# EasyEDA Pro project ProProject_CAM1320_2024-01-19.epro

# Schematic Schematic1
Create Date: 2024-01-09; Page Name: P1; Project Name: CAM1320; Schematic Name: Schematic1; Update Date: 2024-01-09; Company: 嘉立创EDA; Page Size: A4; Version: V1.0
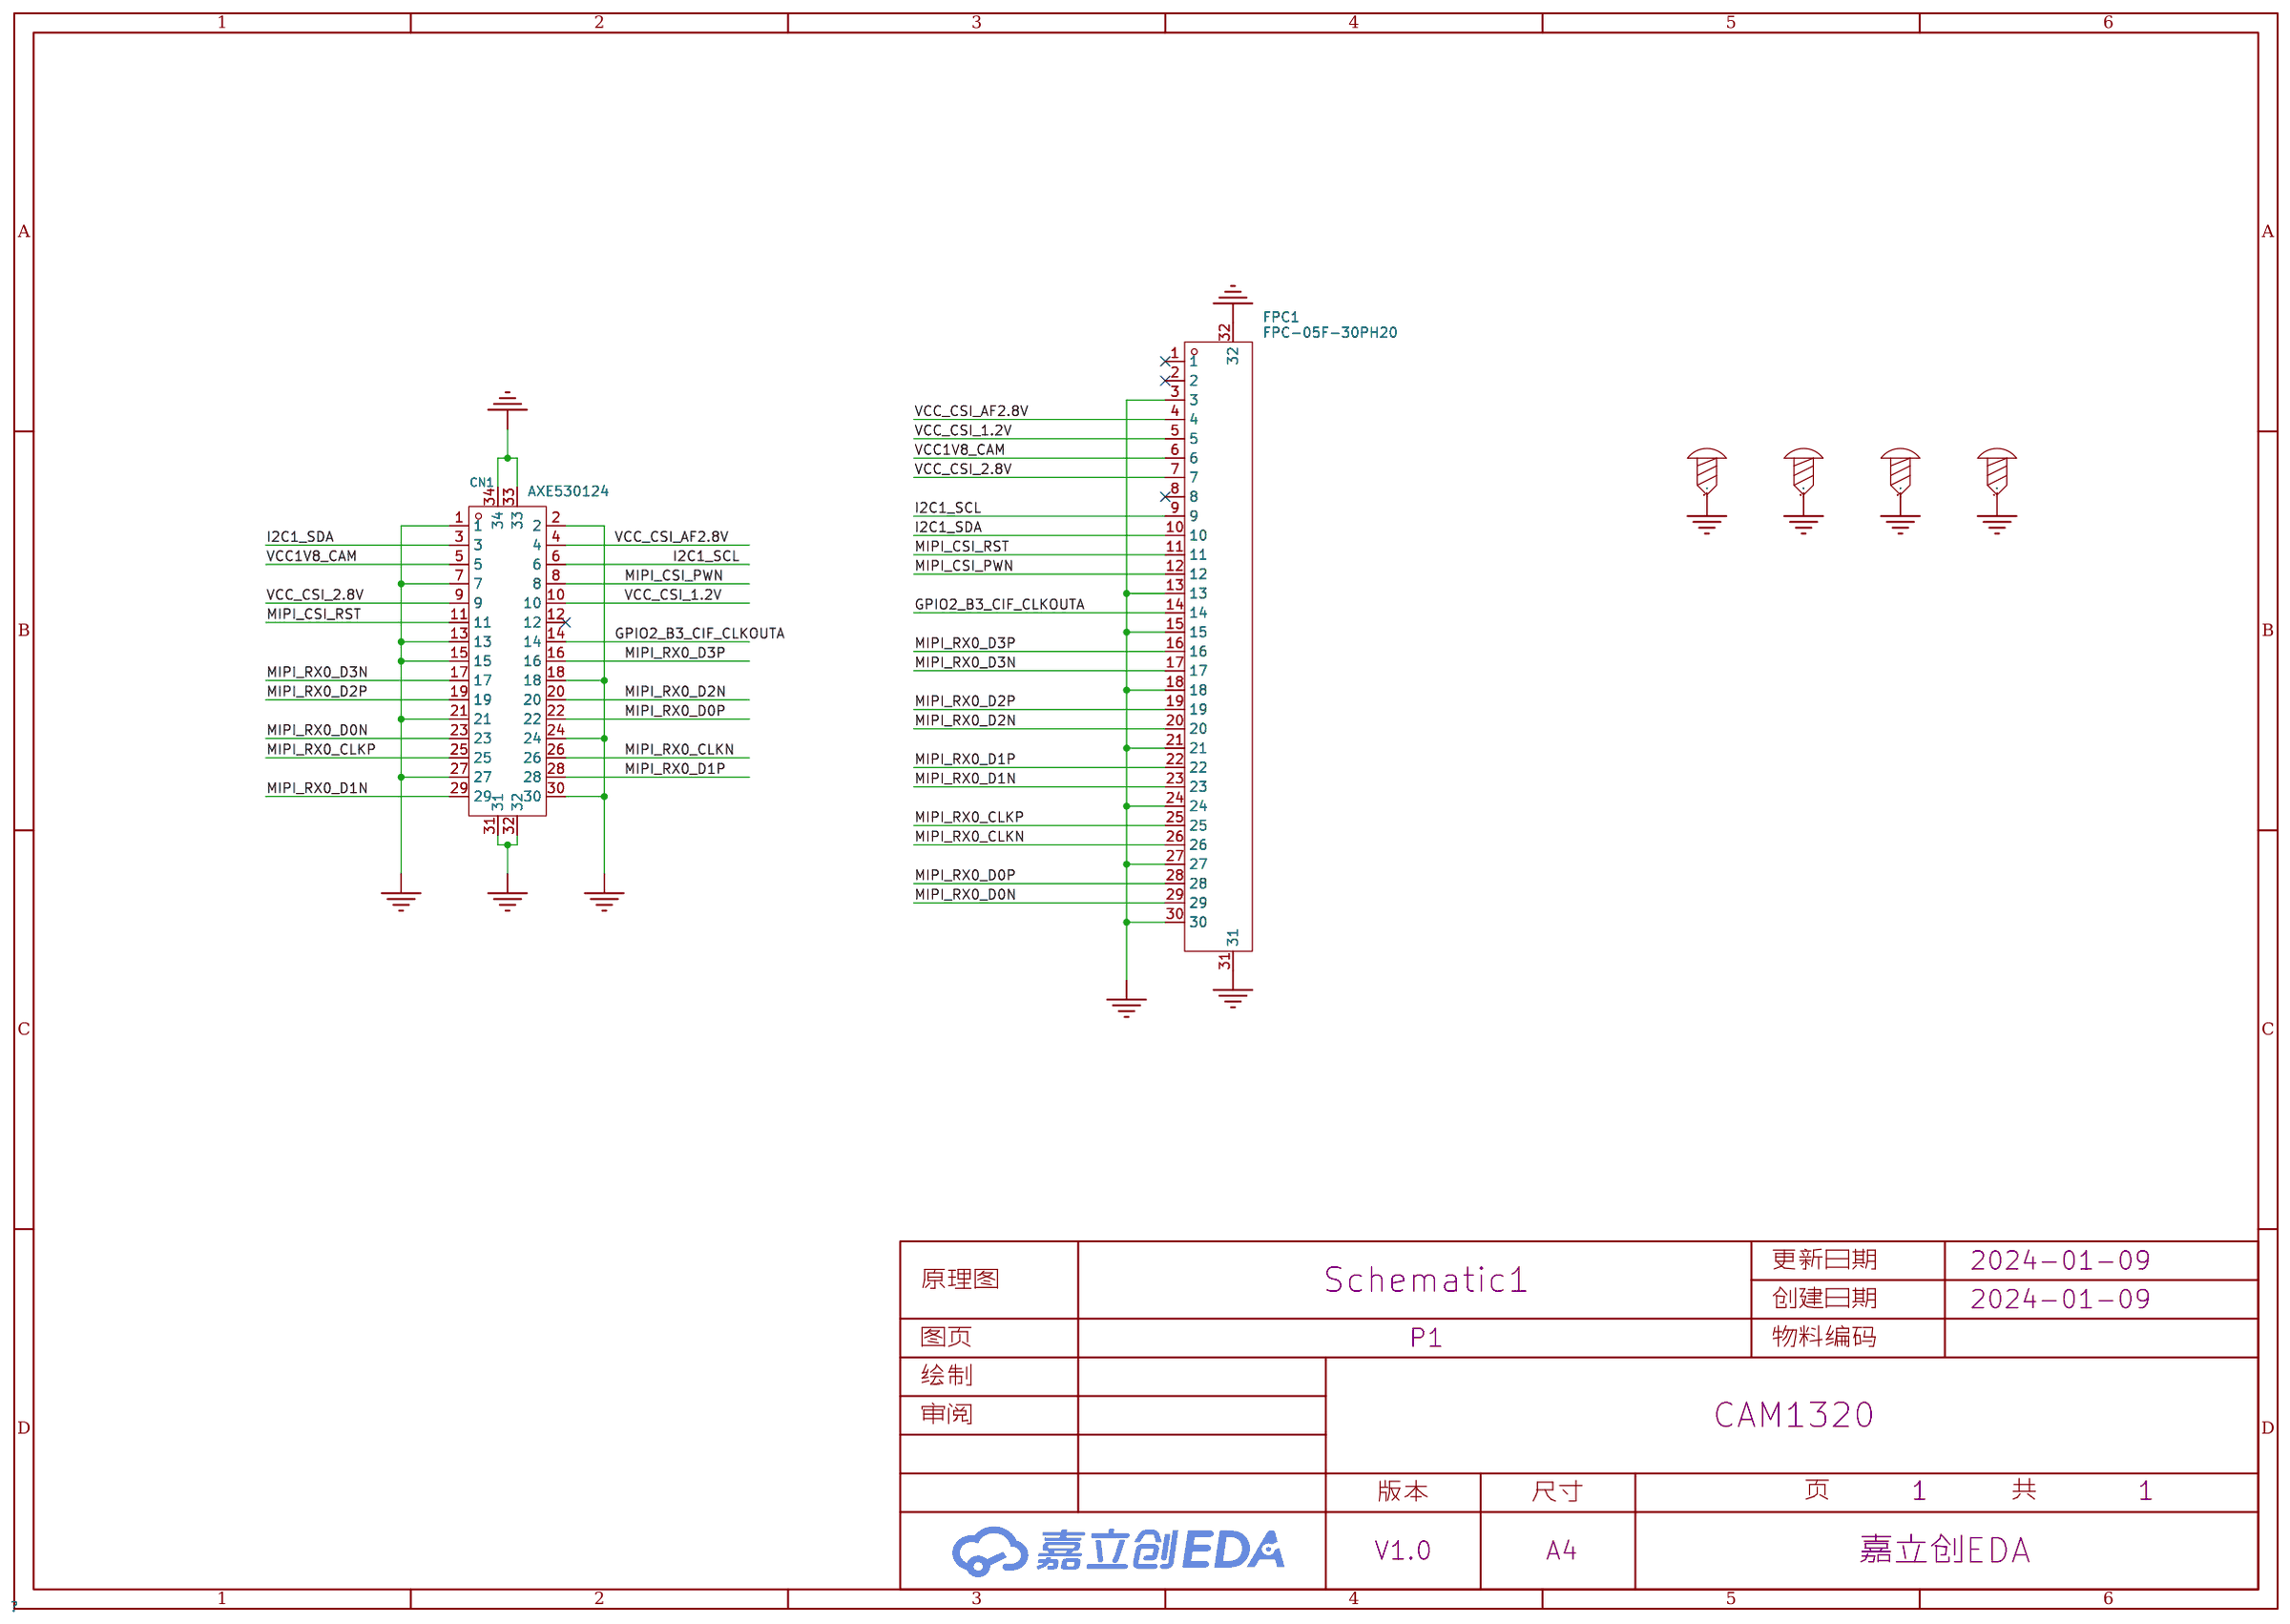
[diagram p0: schematic sheet]

## Parts
CN1  AXE530124  [CONN-SMD_30P-P0.40_AXE530124]
FPC1  FPC-05F-30PH20  [FPC-SMD_30P-P0.50_XUNPU_FPC-05F-30PH20]
U1  -  [M2螺丝]
U2  -  [M2螺丝]
U3  -  [M2螺丝]
U4  -  [M2螺丝]

## Library data of the parts
CN1 = AXE530124: PIN总数:30P;间距:0.4mm;行数:2;公母:母;安装方式:立贴;; LCSC Part Name: PIN：30P 间距0.4mm 母 立贴; Supplier Part: C2982221; Manufacturer: PANASONIC(松下); Supplier Footprint: SMD,P=0.4mm; JLCPCB Part Class: 扩展库; Datasheet: https://atta.szlcsc.com/upload/public/pdf/source/20220321/837E01DAC62F4717309CF420BCC72F47.pdf; Supplier: LCSC; Number of Pins: 30P; Pitch: 0.4mm; Number of Rows: 2; Gender: 母; Mounting Style: 立贴
FPC1 = FPC-05F-30PH20: 间距:0.5mm;触点数量:30P;锁定特性:翻盖式;触点类型:下接;安装类型:卧贴;工作温度范围:-25℃~+85℃;; LCSC Part Name: 间距:0.5mm P数:30P 翻盖式 下接; Supplier Part: C2856808; Manufacturer: XUNPU(讯普); Supplier Footprint: SMD,P=0.5mm,卧贴; JLCPCB Part Class: 扩展库; Datasheet: https://atta.szlcsc.com/upload/public/pdf/source/20210922/C2856808_4E6DDE2793CFD9EF09B771A8BD3338A4.pdf; Supplier: LCSC; Pitch: 0.5mm; Number of Contacts: 30P; Locking Feature: 翻盖式; FFC, FCB Thickness: 0.3mm; Contact Type: 下接; Mounting Type: 卧贴; Height Above Board: 2mm; Operating Temperature Range: -25℃~+85℃
U1-U4 = M2螺丝: Supplier Footprint: 插件

## Nets
GND: CN1.1 CN1.2 CN1.7 CN1.13 CN1.15 CN1.18 CN1.21 CN1.24 CN1.27 CN1.30 CN1.31 CN1.32 CN1.33 CN1.34 FPC1.3 FPC1.13 FPC1.15 FPC1.18 FPC1.21 FPC1.24 FPC1.27 FPC1.30 FPC1.31 FPC1.32 U1.1 U2.1 U3.1 U4.1
VCC1V8_CAM: CN1.5 FPC1.6
VCC_CSI_1.2V: CN1.10 FPC1.5
VCC_CSI_2.8V: CN1.9 FPC1.7
VCC_CSI_AF2.8V: CN1.4 FPC1.4
GPIO2_B3_CIF_CLKOUTA: CN1.14 FPC1.14
I2C1_SCL: CN1.6 FPC1.9
I2C1_SDA: CN1.3 FPC1.10
MIPI_CSI_PWN: CN1.8 FPC1.12
MIPI_CSI_RST: CN1.11 FPC1.11
MIPI_RX0_CLKN: CN1.26 FPC1.26
MIPI_RX0_CLKP: CN1.25 FPC1.25
MIPI_RX0_D0N: CN1.23 FPC1.29
MIPI_RX0_D0P: CN1.22 FPC1.28
MIPI_RX0_D1N: CN1.29 FPC1.23
MIPI_RX0_D1P: CN1.28 FPC1.22
MIPI_RX0_D2N: CN1.20 FPC1.20
MIPI_RX0_D2P: CN1.19 FPC1.19
MIPI_RX0_D3N: CN1.17 FPC1.17
MIPI_RX0_D3P: CN1.16 FPC1.16

Not connected (* = marked no-connect by the designer): CN1 12*; FPC1 1* 2* 8*

# Board PCB1
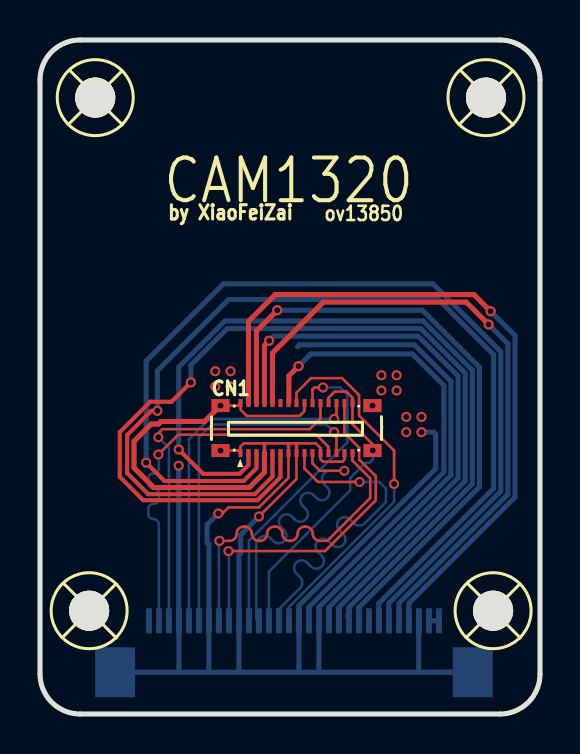
[diagram p1: board, top side]
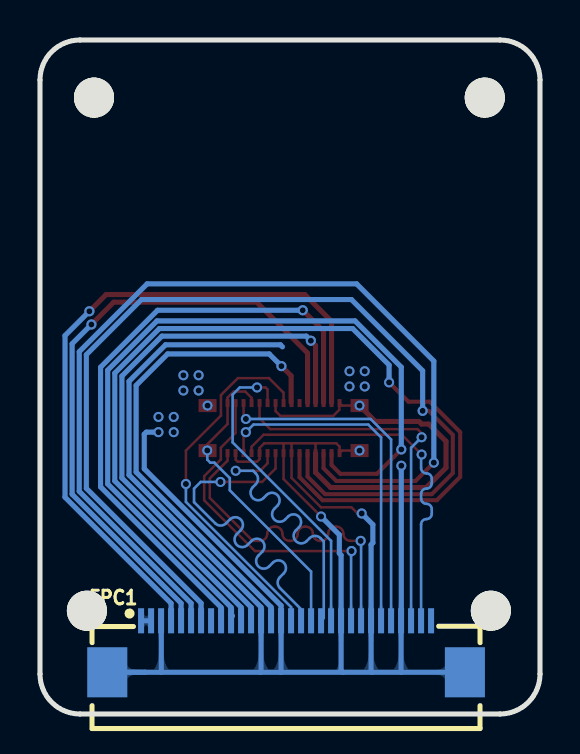
[diagram p2: board, bottom side, seen from below]

Outline 25 x 33.7 mm; copper layers: Top Layer, Bottom Layer. Coordinates in mm from the lower left corner of the outline.
Outline path: 0,31.7 0,2 arc(0.59,0.59) 2,0 23,0 arc(24.41,0.59) 25,2 25,31.7 arc(24.41,33.11) 23,33.7 2,33.7 arc(0.59,33.11) 0,31.7
Stack: Top Layer 0.035mm / Dielectric1 1.51mm FR4 er 4.5 / Bottom Layer 0.035mm

## Design rules (mm)
net MIPI_RX0_D1N: MIPI_RX0_D1
net MIPI_RX0_CLKP: MIPI_RX0_CLK
net MIPI_RX0_D0N: MIPI_RX0_D0
net MIPI_RX0_D1P: MIPI_RX0_D1
net MIPI_RX0_CLKN: MIPI_RX0_CLK
net MIPI_RX0_D0P: MIPI_RX0_D0
net MIPI_RX0_D3P: MIPI_RX0_D3
net MIPI_RX0_D3N: MIPI_RX0_D3
net MIPI_RX0_D2P: MIPI_RX0_D2
net MIPI_RX0_D2N: MIPI_RX0_D2
template: JLCPCB Capability(Two Layers Board)
spacing copperThickness1oz (default): track to track 0.102, other pairs 0.152 to 0.3
spacing copperThickness2oz: track to track 0.203, other pairs 0.152 to 0.3
track width copperThickness1oz (default): min 0.127, default 0.254, max 2.54
track width copperThickness2oz: min 0.203, default 0.254, max 2.54
differential pair differentialPair (default): width min 0.127, default 0.254, max 2.54; gap min 0.152, default 0.152
via viaSize (default): diameter min 0.5, default 0.61, max 10; hole min 0.3, default 0.305, max 6.3

## Placement (name value [footprint] x y rotation side)
CN1  AXE530124  [CONN-SMD_30P-P0.40_AXE530124]  12.82 14.3 0 top
FPC1  FPC-05F-30PH20  [FPC-SMD_30P-P0.50_XUNPU_FPC-05F-30PH20]  12.7 3.37 180 bottom
U1  -  [M2螺丝]  2.76 30.82 0 top
U2  -  [M2螺丝]  2.46 5.16 0 top
U3  -  [M2螺丝]  22.65 5.16 0 top
U4  -  [M2螺丝]  22.3 30.82 0 top

## Footprints (pads in the part's own frame, mm; a bottom-side part is the same pattern mirrored in y, then rotated)
CONN-SMD_30P-P0.40_AXE530124
  rect 0.2x0.4 smd: 1(-2.8,-1.25) 2(-2.8,1.25) 3(-2.4,-1.25) 4(-2.4,1.25) 5(-2,-1.25) 6(-2,1.25) 7(-1.6,-1.25) 8(-1.6,1.25) 9(-1.2,-1.25) 10(-1.2,1.25) 11(-0.8,-1.25) 12(-0.8,1.25) 13(-0.4,-1.25) 14(-0.4,1.25) 15(0,-1.25) 16(0,1.25) 17(0.4,-1.25) 18(0.4,1.25) 19(0.8,-1.25) 20(0.8,1.25) 21(1.2,-1.25) 22(1.2,1.25) 23(1.6,-1.25) 24(1.6,1.25) 25(2,-1.25) 26(2,1.25) 27(2.4,-1.25) 28(2.4,1.25) 29(2.8,-1.25) 30(2.8,1.25)
  rect 0.9x0.65 smd: 31(3.8,1.125) 32(3.8,-1.125) 33(-3.8,-1.125) 34(-3.8,1.125)
FPC-SMD_30P-P0.50_XUNPU_FPC-05F-30PH20
  rect 0.3x1.25 smd: 1(-7.25,1.288) 2(-6.75,1.288) 3(-6.25,1.288) 4(-5.75,1.288) 5(-5.25,1.288) 6(-4.75,1.288) 7(-4.25,1.288) 8(-3.75,1.288) 9(-3.25,1.288) 10(-2.75,1.288) 11(-2.25,1.288) 12(-1.75,1.288) 13(-1.25,1.288) 14(-0.75,1.288) 15(-0.25,1.288) 16(0.25,1.288) 17(0.75,1.288) 18(1.25,1.288) 19(1.75,1.288) 20(2.25,1.288) 21(2.75,1.288) 22(3.25,1.288) 23(3.75,1.288) 24(4.25,1.288) 25(4.75,1.288) 26(5.25,1.288) 27(5.75,1.288) 28(6.25,1.288) 29(6.75,1.288) 30(7.25,1.288)
  rect 2x2.5 smd: 31(8.94,-1.288) 32(-8.94,-1.288)
M2螺丝
  round 2 hole 2: 1(0,0)

## Nets
As in the schematic.

Pads without a net: CN1 12; FPC1 1 2 8

## Via types
v1: diameter 0.508, hole 0.305, Top Layer to Bottom Layer, 3 vias
v2: diameter 0.503, hole 0.305, Top Layer to Bottom Layer, 28 vias
v3: diameter 0.508, hole 0.3, Top Layer to Bottom Layer, 7 vias

## Routing (per net, layer and track width the routed paths; a pad name or vN(x,y) marks a point on that pad's centre or on a via; arc(x,y) is an arc through that point)
GND: length 144.4
  Top Layer w0.127: CN1.27 15.21,13.04 15.21,12.72 15.12,12.62 14.15,12.62 14.02,12.74 CN1.21 14.02,13.3 13.79,13.53 12.84,13.53 ; v2(10.95,9.88) 12.82,11.75 CN1.15 12.82,13.52 12.84,13.53 ; 11.23,13.53 12.45,13.53 ; 11.23,13.53 11.22,13.53 CN1.7 ; 11.23,13.53 10.19,13.53 10.02,13.37 10.02,13.05 9.9,13.17 v2(9.02,13.17) ; 12.45,13.53 12.42,13.5 CN1.13 12.42,11.81 10.95,10.33 9.42,10.33 9.12,10.03 v2(8.92,10.03) ; 12.45,13.53 12.84,13.53 ; CN1.24 14.42,15.81 14.74,16.12 15.32,16.12 15.62,15.82 CN1.30 15.62,14.5 16.62,13.5 CN1.32 ; v2(9.02,15.42) 9.9,15.42 10.02,15.55 10.03,15.53 10.03,15.21 10.34,14.9 12.98,14.9 13.22,15.15 CN1.18
  Top Layer w0.254: CN1.7 11.22,12.08 10.47,11.32 5.69,11.32 4.7,12.31 4.7,13.63 5.56,14.5 5.92,14.5 6.05,14.63 8.23,14.63 v2(9.02,15.42)
  Bottom Layer w0.127: FPC1.18 11.45,7.12 15.51,11.19 15.51,11.8 16.28,12.57 16.48,12.57 16.64,12.72 v2(16.64,13.18)
  Bottom Layer w0.254: 12.95,2.09 12.95,2.1 FPC1.15 12.95,5.42 19.79,12.26 19.79,13.99 19.69,14.09 v2(19.08,14.09) ; 12.95,2.09 13.97,2.09 ; 12.95,2.09 9.85,2.09 ; FPC1.3 18.93,4.65 18.93,2.09 ; 9.85,2.09 9.95,2.18 FPC1.21 9.95,7.94 10.03,8.03 10.03,8.96 v2(10.95,9.88) ; 9.85,2.09 8.39,2.09 ; 19.74,2.09 21.62,2.1 FPC1.32 19.74,2.09 ; 19.74,2.09 18.93,2.09 ; 6.93,2.09 8.39,2.09 ; 6.93,2.09 FPC1.31 ; 6.93,2.09 6.95,2.1 FPC1.27 6.93,4.67 v2(6.93,12.41) ; 8.39,2.09 8.45,2.14 FPC1.24 8.45,8.47 8.36,8.55 8.36,9.47 v2(8.92,10.03) ; 12.88,18.36 12.98,18.46 18.72,18.46 20.55,16.63 20.55,11.95 13.95,5.34 FPC1.13 13.95,2.11 13.97,2.09 ; 18.93,2.09 13.97,2.09
  vias: v2(8.76,17.14) v2(8.76,16.38) v2(9.53,17.14) v2(9.53,16.38) v2(16.62,15.42) v2(17.07,16.94) v2(17.07,16.17) v2(17.83,16.94) v2(17.83,16.17) v2(18.31,14.85) v2(18.31,14.09) v2(19.08,14.85)
VCC1V8_CAM: length 48.5
  Top Layer w0.203: CN1.5 10.82,12.29 10.19,11.65 6.22,11.65 v2(5.31,12.57)
  Bottom Layer w0.254: v2(5.31,12.57) 5.31,17.65 9.17,21.51 19.64,21.51 23.04,18.11 23.04,11.13 17.44,5.54 17.44,4.66
VCC_CSI_1.2V: length 32.3
  Top Layer w0.254: CN1.10 11.62,18.05 14.17,20.59 21.31,20.59 v3(22.43,19.48)
  Bottom Layer w0.254: FPC1.5 17.95,5.54 23.39,10.99 23.39,18.51 v3(22.43,19.48)
VCC_CSI_2.8V: length 50.3
  Top Layer w0.203: v3(5.87,15.16) 5.56,15.16 4.36,13.95 4.36,12.04 5.41,10.99 10.74,10.99 11.62,11.87 CN1.9
  Bottom Layer w0.254: 16.94,4.66 16.94,5.54 22.68,11.28 22.68,17.97 19.93,20.72 9.43,20.72 5.87,17.16 v3(5.87,15.16)
VCC_CSI_AF2.8V: length 35.3
  Top Layer w0.254: CN1.4 10.42,19.63 11.76,20.97 21.69,20.97 v3(22.53,20.14)
  Bottom Layer w0.254: FPC1.4 18.45,5.54 23.75,10.84 23.75,18.92 v3(22.53,20.14)
(no net): length 0.5
  Bottom Layer w0.254: FPC1.1 FPC1.2
GPIO2_B3_CIF_CLKOUTA: length 24.8
  Top Layer w0.254: 12.44,15.57 12.44,16.91 v3(12.93,17.39)
  Bottom Layer w0.254: v3(12.93,17.39) 13.54,18 18.62,18 20.19,16.43 20.19,12.09 13.44,5.34 13.44,4.66
I2C1_SCL: length 31.5
  Top Layer w0.254: v3(11.86,20.19) 10.82,19.15 CN1.6
  Bottom Layer w0.254: v3(11.86,20.19) 19.12,20.19 21.97,17.34 21.97,11.36 15.95,5.33 FPC1.9
I2C1_SDA: length 40.4
  Top Layer w0.203: v3(6.93,13.23) 8.15,12.01 9.98,12.01 10.42,12.45 CN1.3
  Bottom Layer w0.254: v3(6.93,13.23) 6.93,17.34 9.25,19.66 19.15,19.66 21.62,17.19 21.62,11.5 15.44,5.33 15.44,4.97 15.37,4.9
MIPI_CSI_PWN: length 28.5
  Top Layer w0.254: v3(11.46,18.66) 11.22,18.43 11.22,15.55
  Bottom Layer w0.254: 14.44,4.66 14.44,5.34 20.9,11.8 20.9,16.9 18.91,18.89 11.69,18.89 v3(11.46,18.66)
MIPI_CSI_RST: length 48.3
  Top Layer w0.203: v2(7.54,16.58) 6.58,15.62 5.51,15.62 3.99,14.09 3.99,11.86 5.16,10.69 10.87,10.69 12.02,11.84 12.02,13.05
  Bottom Layer w0.254: v2(7.54,16.58) 7.54,17.45 9.37,19.27 19.03,19.27 21.26,17.04 21.26,11.65 14.95,5.34 FPC1.11
MIPI_RX0_CLKN: length 17.6
  Top Layer w0.127: v2(14.71,14.75) 14.82,14.87 CN1.26
  Bottom Layer w0.127: v2(14.71,14.75) 8.47,14.75 7.45,13.73 FPC1.26
MIPI_RX0_CLKP: length 17.4
  Top Layer w0.127: v1(14.71,14.09) 14.82,13.98 CN1.25
  Bottom Layer w0.127: v1(14.71,14.09) 14.33,14.47 8.59,14.47 7.95,13.83 FPC1.25
MIPI_RX0_D0N: length 19
  Top Layer w0.127: CN1.23 14.42,13.36 13.82,13.96 6.91,13.96 v2(5.92,12.97)
  Bottom Layer w0.127: FPC1.29 5.95,9.48 arc(5.87,9.67) 5.68,9.75 arc(5.49,9.83) 5.41,10.01 5.41,10.24 arc(5.49,10.43) 5.68,10.51 arc(5.87,10.59) 5.95,10.78 5.95,11 arc(5.87,11.19) 5.68,11.27 arc(5.49,11.35) 5.41,11.54 5.41,11.77 arc(5.49,11.95) 5.68,12.03 arc(5.87,12.11) 5.95,12.3 5.95,12.95 v2(5.92,12.97)
MIPI_RX0_D0P: length 18.8
  Top Layer w0.127: CN1.22 14.02,14.78 13.49,14.24 6.12,14.24 5.92,14.04 v2(5.92,13.84)
  Bottom Layer w0.127: FPC1.28 6.45,13.31 v2(5.92,13.84)
MIPI_RX0_D1N: length 17.5
  Top Layer w0.127: v1(8.97,8.66) 9.47,8.66 arc(9.73,8.76) 9.83,9.01 arc(9.93,9.26) 10.19,9.37 10.24,9.37 arc(10.49,9.26) 10.59,9.01 arc(10.7,8.76) 10.95,8.66 11,8.66 arc(11.25,8.76) 11.35,9.01 arc(11.46,9.26) 11.71,9.37 11.76,9.37 arc(12.01,9.26) 12.12,9.01 arc(12.22,8.76) 12.47,8.66 12.52,8.66 arc(12.77,8.76) 12.88,9.01 arc(12.98,9.26) 13.23,9.37 13.28,9.37 arc(13.54,9.26) 13.64,9.01 arc(13.74,8.76) 14,8.66 14.36,8.66 16.51,10.8 16.51,11.78 15.62,12.67 15.62,13.04
  Bottom Layer w0.127: FPC1.23 8.95,8.63 v1(8.97,8.66)
MIPI_RX0_D1P: length 17.4
  Top Layer w0.127: CN1.28 15.22,14.05 15.96,13.32 15.96,12.73 16.79,11.89 16.79,10.69 14.25,8.15 v1(9.42,8.15)
  Bottom Layer w0.127: FPC1.22 9.45,8.13 v1(9.42,8.15)
MIPI_RX0_D2N: length 16
  Top Layer w0.127: v2(14.15,16.33) 13.72,16.33 13.62,16.23 CN1.20
  Bottom Layer w0.127: FPC1.20 10.45,8.66 15.37,13.58 15.37,15.97 15.01,16.33 v2(14.15,16.33)
MIPI_RX0_D2P: length 16
  Top Layer w0.127: CN1.19 13.62,12.53 14,12.16 v2(15.21,12.16)
  Bottom Layer w0.127: FPC1.19 10.81,4.8 10.81,8.63 10.98,8.79 arc(11.25,8.91) 11.52,8.79 11.67,8.64 arc(12.21,8.64) 12.21,9.18 12.06,9.33 arc(12.06,9.87) 12.59,9.87 12.75,9.72 arc(13.28,9.72) 13.28,10.26 13.13,10.41 arc(13.13,10.95) 13.67,10.95 13.82,10.8 arc(14.36,10.8) 14.36,11.34 14.21,11.49 arc(14.1,11.76) 14.21,12.03 14.34,12.16 v2(15.21,12.16)
MIPI_RX0_D3N: length 18.3
  Top Layer w0.127: v2(15.98,11.6) 13.89,11.6 13.22,12.27 CN1.17
  Bottom Layer w0.127: FPC1.17 11.95,5.24 13,6.3 arc(13.12,6.57) 13,6.84 12.81,7.03 arc(12.81,7.57) 13.35,7.57 13.54,7.38 arc(14.08,7.38) 14.08,7.92 13.89,8.11 arc(13.89,8.65) 14.43,8.65 14.62,8.46 arc(15.16,8.46) 15.16,9 14.97,9.19 arc(14.97,9.73) 15.5,9.73 15.7,9.53 arc(15.97,9.42) 16.24,9.53 17.3,10.59 17.3,11.27 16.97,11.6 v2(15.98,11.6)
MIPI_RX0_D3P: length 18.5
  Top Layer w0.127: v2(17.7,11.5) 17.7,13.17 15.95,14.92 15.95,15.95 15.1,16.79 13.55,16.79 12.82,16.07 CN1.16
  Bottom Layer w0.127: FPC1.16 12.45,5.35 17.7,10.61 v2(17.7,11.5)

## Copper pours and planes (outline as drawn; the poured copper is in the pictures)
GND on Top Layer: -1.65,35.02 26.75,35.02 26.75,-2.72 -1.65,-2.72
GND on Bottom Layer: -0.79,34.06 25.68,34.06 25.68,-1.45 -0.79,-1.45

Small or netless copper shapes (teardrops, artwork), in the pictures only: 48 on Top Layer, 46 on Bottom Layer

## Text on the board
Top Silkscreen Layer: ov13850 | by XiaoFeiZai | CAM1320
